# Altium schematic sheet Sheet2.SchDoc
size A4
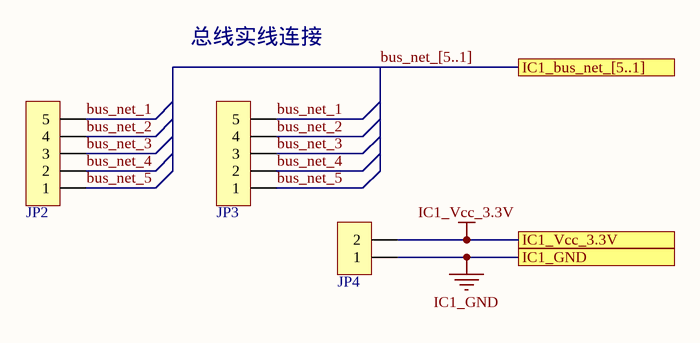
[diagram p0: Sheet2.SchDoc]

## Parts
JP2  HDR-1X5  [HDR2.54-LI-5P]  (value not drawn)
JP3  HDR-1X5  [HDR2.54-LI-5P]  (value not drawn)
JP4  HDR-1X2  [HDR2.54-LI-2P]  (value not drawn)

## Ports
IC1_bus_net_[5..1], IC1_GND, IC1_Vcc_3.3V

## Nets
IC1_GND: JP4.1 ; port IC1_GND
IC1_Vcc_3.3V: JP4.2 ; port IC1_Vcc_3.3V
bus_net_1: JP2.5 JP3.5
bus_net_2: JP2.4 JP3.4
bus_net_3: JP2.3 JP3.3
bus_net_4: JP2.2 JP3.2
bus_net_5: JP2.1 JP3.1

## Buses and harness runs
bus bus_net_[5..1] = port IC1_bus_net_[5..1]

## Notes on the sheet
- 总线实线连接

## Library data of the parts
JP2 JP3 = Header 5: 5P接插件; 版权归属: 源创客; BOM名称: 5P接插件; 学习资源: www.ooocke.com
JP4 = Header 2: 2P接插件; 版权归属: 源创客; BOM名称: 2P接插件; 学习资源: www.ooocke.com